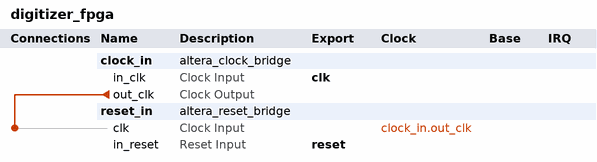
[diagram p0: system contents]
# Platform Designer (Qsys) system digitizer_fpga, Cyclone 10 GX 10CX220YF780E5G
# Parameters at their usual value, and those the tool derives, are not listed.
package require -exact qsys 1.0
create_system digitizer_fpga
set_project_property DEVICE_FAMILY {Cyclone 10 GX}
set_project_property DEVICE 10CX220YF780E5G

add_component clock_in ip/digitizer_fpga/digitizer_fpga_clock_in.ip altera_clock_bridge clock_in 18.1
load_component clock_in
set_component_parameter_value DERIVED_CLOCK_RATE 0
set_component_parameter_value EXPLICIT_CLOCK_RATE 50000000
save_component

add_component reset_in ip/digitizer_fpga/digitizer_fpga_reset_in.ip altera_reset_bridge reset_in 18.1

# connections
add_connection clock_in.out_clk reset_in.clk clock

# exported interfaces
add_interface clk clock sink
set_interface_property clk EXPORT_OF clock_in.in_clk
add_interface reset reset sink
set_interface_property reset EXPORT_OF reset_in.in_reset

set_interconnect_requirement {$system} qsys_mm.clockCrossingAdapter HANDSHAKE
set_interconnect_requirement {$system} qsys_mm.enableEccProtection FALSE
set_interconnect_requirement {$system} qsys_mm.insertDefaultSlave FALSE
set_interconnect_requirement {$system} qsys_mm.maxAdditionalLatency 1

save_system digitizer_fpga.qsys
